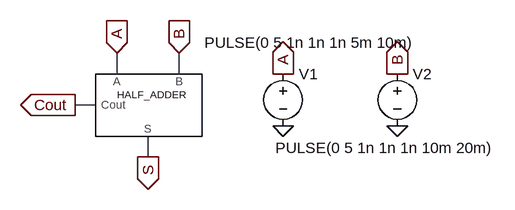
[diagram p0: schematic Simulated_Half_Adder.asc]
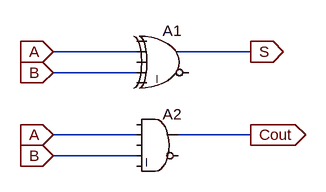
[diagram p1: sub-circuit half_adder.asc]
Simulated_Half_Adder.asc, the LTspice schematic file:
Version 4
SHEET 1 880 680
WIRE -32 96 -32 64
WIRE 64 96 64 64
WIRE -64 144 -96 144
WIRE 16 224 16 192
FLAG -32 64 A
IOPIN -32 64 In
FLAG 64 64 B
IOPIN 64 64 In
FLAG -96 144 Cout
IOPIN -96 144 Out
FLAG 16 224 S
IOPIN 16 224 Out
FLAG 224 176 0
FLAG 400 176 0
FLAG 224 96 A
IOPIN 224 96 Out
FLAG 400 96 B
IOPIN 400 96 Out
SYMBOL Half_Adder 16 144 R0
SYMATTR InstName HALF_ADDER
SYMBOL voltage 224 80 R0
WINDOW 3 -121 -32 Left 2
WINDOW 123 0 0 Left 0
WINDOW 39 0 0 Left 0
SYMATTR Value PULSE(0 5 1n 1n 1n 5m 10m)
SYMATTR InstName V1
SYMBOL voltage 400 80 R0
WINDOW 3 -188 130 Left 2
WINDOW 123 0 0 Left 0
WINDOW 39 0 0 Left 0
SYMATTR Value PULSE(0 5 1n 1n 1n 10m 20m)
SYMATTR InstName V2

half_adder.asc, the sub-circuit schematic file:
Version 4
SHEET 1 880 680
WIRE 128 80 0 80
WIRE 304 80 192 80
WIRE 128 112 0 112
WIRE 128 208 0 208
WIRE 304 208 192 208
WIRE 128 240 0 240
FLAG 0 80 A
IOPIN 0 80 In
FLAG 0 208 A
IOPIN 0 208 In
FLAG 0 112 B
IOPIN 0 112 In
FLAG 0 240 B
IOPIN 0 240 In
FLAG 304 80 S
IOPIN 304 80 Out
FLAG 304 208 Cout
IOPIN 304 208 Out
SYMBOL Digital\\xor 176 32 R0
SYMATTR InstName A1
SYMBOL Digital\\and 160 160 R0
SYMATTR InstName A2

The netlist it stands for:
* Simulated_Half_Adder.asc
XHALF_ADDER A B Cout S half_adder
V1 A 0 PULSE(0 5 1n 1n 1n 5m 10m)
V2 B 0 PULSE(0 5 1n 1n 1n 10m 20m)

* block symbol definitions
.subckt half_adder A B Cout S
A1 0 A 0 B 0 0 S 0 XOR
A2 0 A 0 B 0 0 Cout 0 AND
.ends half_adder

.backanno
.end